# EAGLE design cougar mmjoy (EAGLE 7.5.0)
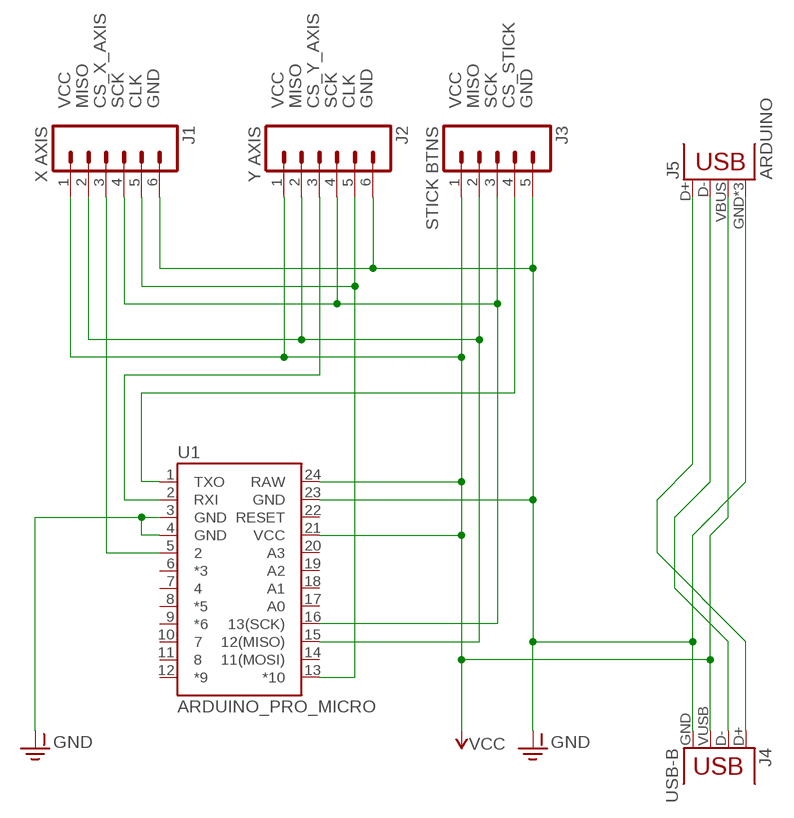
[diagram p0: schematic, sheet 1]

## Parts
J1  X AXIS  M06POLAR_LOCK  [MOLEX-1X6_LOCK]
J2  Y AXIS  M06POLAR_LOCK  [MOLEX-1X6_LOCK]
J3  STICK BTNS  M05LOCK  [1X05_LOCK]
J4  USB-B  USB-B-S  [USB-B-SMT]
J5  ARDUINO  USB-MICROB  [USB-MICROB]
U1  ARDUINO_PRO_MICRO  [ARDUINO_PRO_MICRO]

## Nets
CLK: J1.5 J2.5 U1.13(*10)
CS_STICK: J3.4 U1.1(TXO)
CS_X_AXIS: J1.3 U1.5
CS_Y_AXIS: J2.3 U1.2(RXI)
GND: J1.6 J2.6 J3.5 J4.GND J5.GND J5.MT1(GND) J5.MT2(GND) U1.3(GND) U1.4(GND) U1.23(GND)
MISO: J1.2 J2.2 J3.2 U1.15(12(MISO))
N$3: J4.D- J5.D-
N$4: J4.D+ J5.D+
SCK: J1.4 J2.4 J3.3 U1.16(13(SCK))
VCC: J1.1 J2.1 J3.1 J4.VUSB(VBUS) J5.VBUS U1.21(VCC) U1.24(RAW)
Unconnected: U1.6(*3) U1.7 U1.8(*5) U1.9(*6) U1.10 U1.11 U1.12(*9) U1.14(11(MOSI)) U1.17(A0) U1.18(A1) U1.19(A2) U1.20(A3) U1.22(RESET)

## Library data of the parts
J1 J2 = SparkFun-Connectors:M06: Header 6 Standard 6-pin 0.1" header. Use with straight break away headers (SKU : PRT-00116), right angle break away headers (PRT-00553), swiss pins (PRT-00743), machine pins (PRT-00117), and female headers (PRT-00115). Molex polarized connector foot print use with SKU : PRT-08094 with associated crimp pins and housings. NOTES ON THE VARIANTS LOCK and LOCK_LONGPADS... This footprint was designed to help hold the alignment of a through-hole component (i.e. 6-pin header) while soldering it into place. You may notice that each hole has been shifted either up or down by 0.005 of an inch from it's more standard position (which is a perfectly straight line). This slight alteration caused the pins (the squares in the middle) to touch the edges of the holes. Because they are alternating, it causes a "brace" to hold the component in place. 0.005 has proven to be the perfect amount of "off-center" position when using our standard breakaway headers. Although looks a little odd when you look at the bare footprint, once you have a header in there, the alteration is very hard to notice. Also,if you push a header all the way into place, it is covered up entirely on the bottom side. This idea of altering the position of holes to aid alignment will be further integrated into the Sparkfun Library for other footprints. It can help hold any component with 3 or more connection pins.
J3 = SparkFun-Connectors:M05: Header 5 Standard 5-pin 0.1" header. Use with straight break away headers (SKU : PRT-00116), right angle break away headers (PRT-00553), swiss pins (PRT-00743), machine pins (PRT-00117), and female headers (PRT-00115). Molex polarized connector foot print use with SKU : PRT-08230 with associated crimp pins and housings.
J4 = SparkFun-Connectors:USB: USB Connectors USB-B-PTH is fully proven SKU : PRT-00139/CONN-08278 USB-miniB is fully proven SKU : PRT-00587 USB-A-PCB is untested. USB-A-H is throughly reviewed, but untested. Spark Fun Electronics SKU : PRT-00437 USB-B-SMT is throughly reviewed, but untested. Needs silkscreen touching up. USB-A-S has not been used/tested USB-MB-H has not been used/tested USB-MICROB has been used. CONN-09505
J5 = SparkFun-Connectors:USB: USB Connectors USB-B-PTH is fully proven SKU : PRT-00139/CONN-08278 USB-miniB is fully proven SKU : PRT-00587 USB-A-PCB is untested. USB-A-H is throughly reviewed, but untested. Spark Fun Electronics SKU : PRT-00437 USB-B-SMT is throughly reviewed, but untested. Needs silkscreen touching up. USB-A-S has not been used/tested USB-MB-H has not been used/tested USB-MICROB has been used. CONN-09505; PROD_ID: CONN-09505
U1 = SparkFun-Boards:ARDUINO_PRO_MICRO

## Board
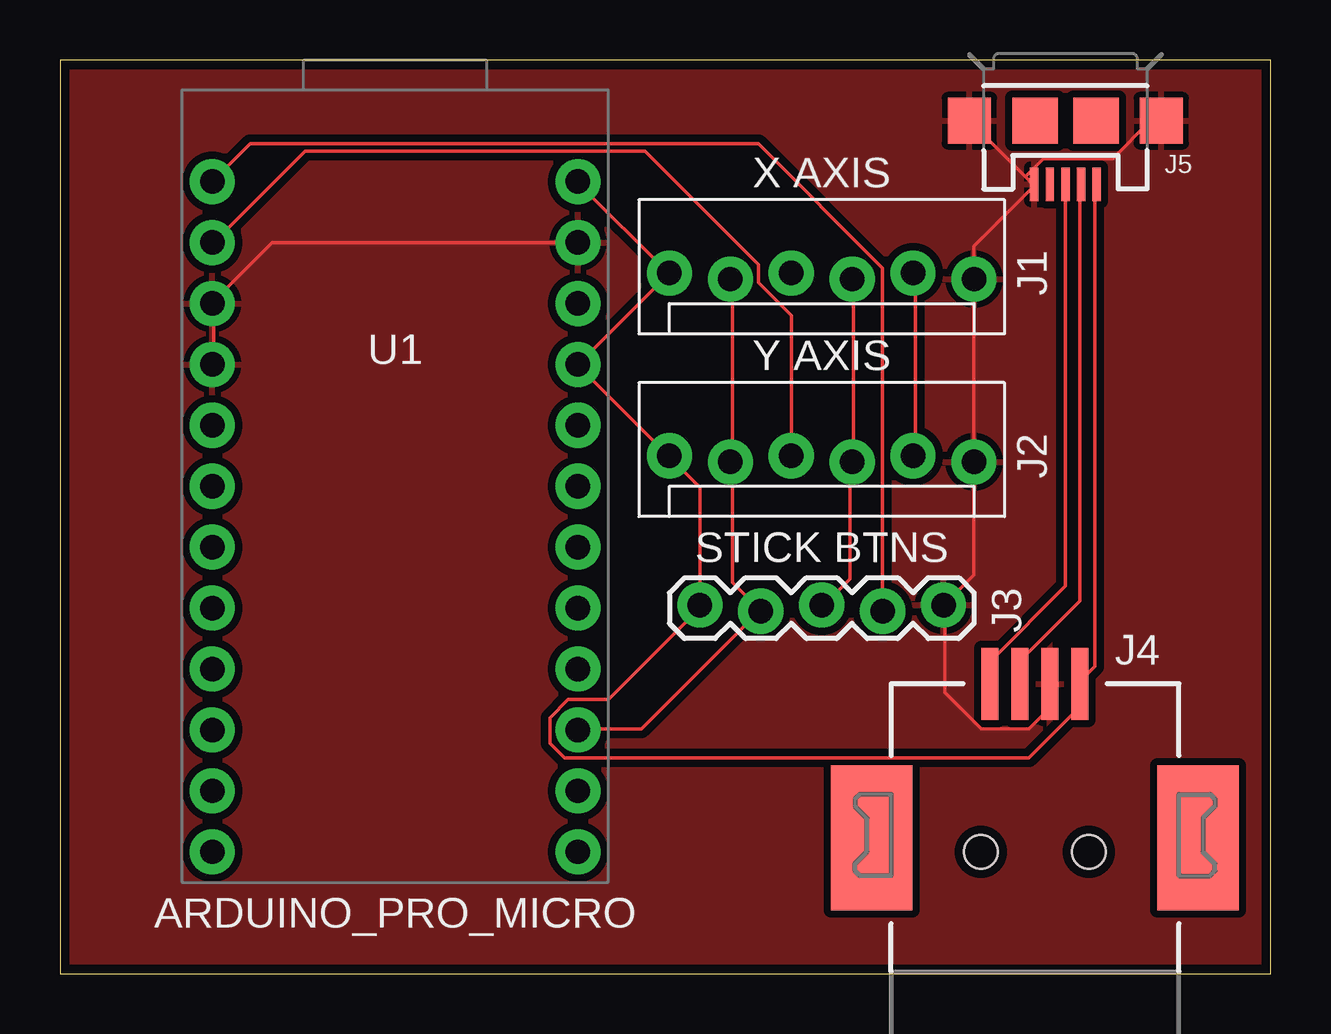
[diagram p1: board, top side]
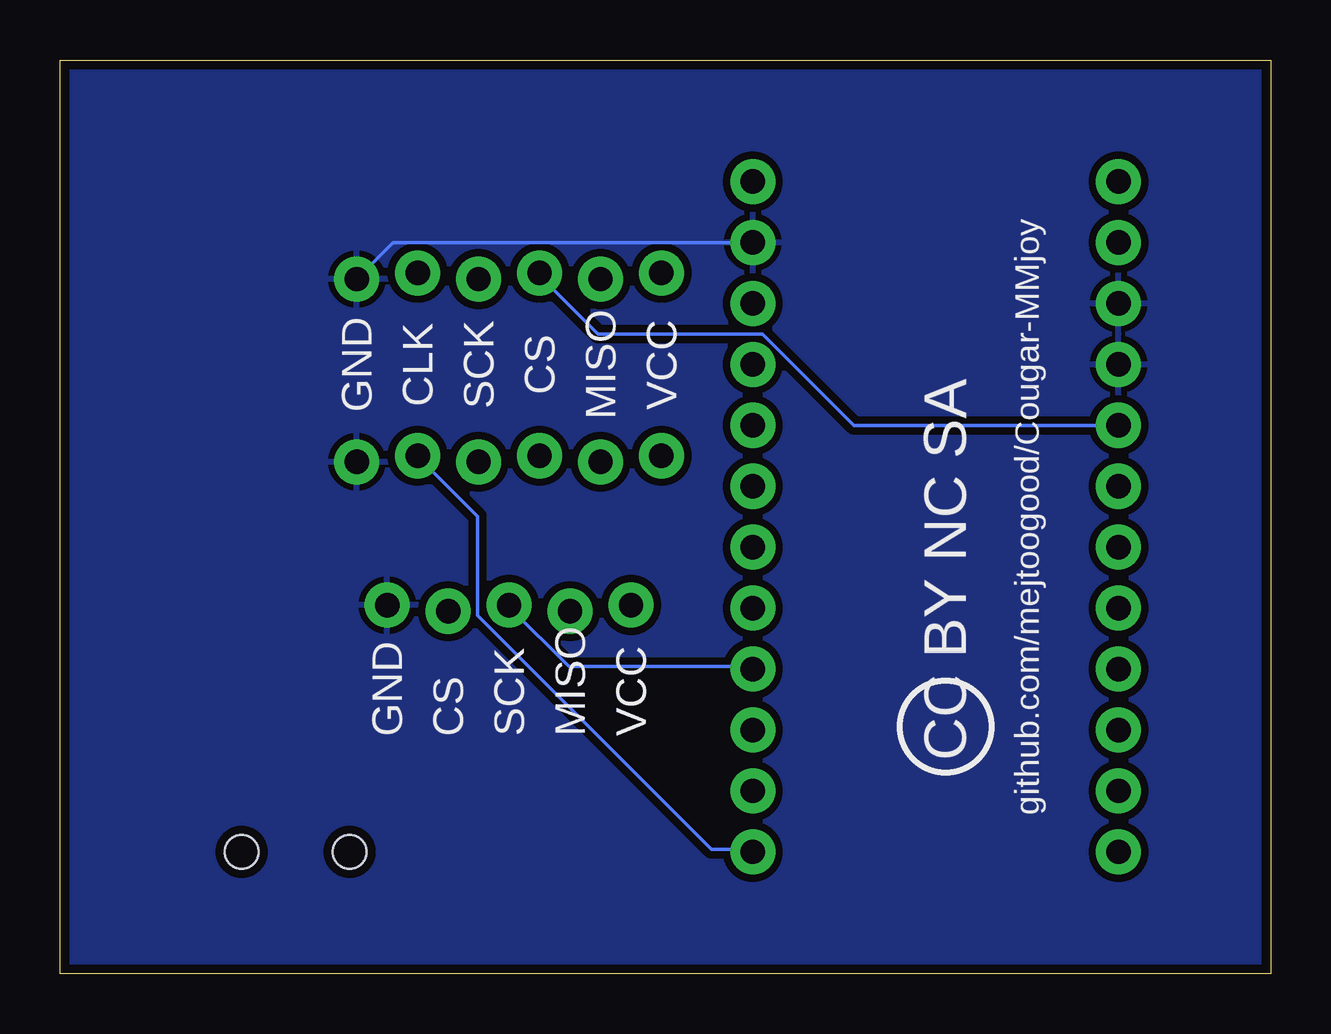
[diagram p2: board, bottom side, seen from below]

Size 50.47 x 38.09 mm. Coordinates in mm from the lower left corner, seen from the top.
Outline: 0,0 50.47,0 50.47,38.09 0,38.09 0,0
Copper layers (1*16): Top 0.0356mm / dielectric 1.5011mm / Bottom 0.0356mm
Design rules "OSH Park 2layer": minimum track width 6mil, minimum drill 13mil, track to track 6mil, track to pad 6mil, pad to pad 6mil, via to via 6mil, smd to smd 6mil, copper to edge 15mil, drill to drill 6mil, minimum pad ring 7mil, minimum via ring 7mil, stop-mask expansion 2.5mil, vias tented up to drill 0mil, thermal gap 10mil

### Footprints (pad centres in the part's own frame; a part is rotated, then mirrored left to right if it is on the bottom)
MOLEX-1X6_LOCK = drill 1.016 pad 1.88: 1 0,0; 2 2.54,-0.254; 3 5.08,0; 4 7.62,-0.254; 5 10.16,0; 6 12.7,-0.254
1X05_LOCK = drill 1.016 pad 1.88: 1 0,0.127; 2 2.54,-0.127; 3 5.08,0.127; 4 7.62,-0.127; 5 10.16,0.127
USB-B-SMT = smd 6.04 x 3.4: 5 0.58,6.8; 6 0.58,-6.8 | smd 3 x 0.7: D+ 7,1.875; D- 7,0.625; GND 7,-0.625; VUSB 7,-1.875 | hole 1.4: 0,2.25; 0,-2.25
USB-MICROB = smd 0.35 x 1.4: D+ 0,2.65; D- -0.65,2.65; GND 1.3,2.65; ID 0.65,2.65; VBUS -1.3,2.65 | smd 1.8 x 1.9: MT1 -4,0; MT2 4,0 | smd 1.9 x 1.9: P$1 -1.27,0; P$2 1.27,0
ARDUINO_PRO_MICRO = drill 1.016 pad 1.88: 1 -7.62,12.7; 2 -7.62,10.16; 3 -7.62,7.62; 4 -7.62,5.08; 5 -7.62,2.54; 6 -7.62,0; 7 -7.62,-2.54; 8 -7.62,-5.08; 9 -7.62,-7.62; 10 -7.62,-10.16; 11 -7.62,-12.7; 12 -7.62,-15.24; 13 7.62,-15.24; 14 7.62,-12.7; 15 7.62,-10.16; 16 7.62,-7.62; 17 7.62,-5.08; 18 7.62,-2.54; 19 7.62,0; 20 7.62,2.54; 21 7.62,5.08; 22 7.62,7.62; 23 7.62,10.16; 24 7.62,12.7

### Placement (x,y rotation side)
J1  25.4,29.21 0 top
J2  25.4,21.59 0 top
J3  26.67,15.24 0 top
J4  40.64,5.08 90 top
J5  41.91,35.56 180 top
U1  13.97,20.32 0 top

### Tracks (layer width: path | path; a pad name or v marks a point on that pad's centre or on a via)
CLK
  Top 0.152: J1.5 35.66,29.11 35.66,21.64 J2.5
  Bottom 0.152: U1.13 21.64,5.18 23.32,5.18 33.07,14.94 33.07,19.05 35.51,21.49 J2.5
CS_STICK
  Top 0.152: J3.4 34.29,29.41 29.11,34.59 7.92,34.59 U1.1
CS_X_AXIS
  Bottom 0.152: U1.5 17.37,22.86 21.18,26.67 28.04,26.67 30.48,29.11 J1.3
CS_Y_AXIS
  Top 0.152: J2.3 30.48,27.43 29.11,28.8 29.11,29.57 24.38,34.29 10.21,34.29 6.4,30.48 U1.2
GND
  Top 0.152: 41.3,13.11 41.3,12.19 J4.GND | 41.15,10.97 41.15,12.04 J4.GND | U1.4 6.4,25.45 6.4,27.89 U1.3 6.4,28.04 8.84,30.48 U1.23 | 40.23,33.22 37.95,35.51 J5.MT2 | 40.23,33.22 40.54,32.92 J5.GND 40.54,32.77 38.1,30.33 J1.6 J2.6 38.1,16.61 36.88,15.39 J3.5 36.88,15.24 36.88,11.73 38.41,10.21 40.39,10.21 41.15,10.97 | 40.23,33.22 41,33.98 43.89,33.98 45.41,35.51 45.87,35.51 J5.MT1 | 41.15,10.97 J4.GND
  Bottom 0.152: U1.23 36.58,30.48 J1.6
  pour Top (isolate 0.305): 0,0 0,38.1 50.8,38.1 50.8,0
  pour Bottom (isolate 0.305): 0,0 0,38.1 50.8,38.1 50.8,0
MISO
  Top 0.152: U1.15 21.64,10.21 24.23,10.21 29.11,15.09 J3.2 29.11,15.24 28.04,16.31 28.04,21.34 | 28.04,21.34 28.04,28.96 J1.2 | 28.04,21.34 J2.2
N$3
  Top 0.152: 40.08,13.11 40.08,12.19 J4.D- 40.08,13.11 | 40.08,13.11 42.52,15.54 42.52,32.77 J5.D-
N$4
  Top 0.152: 38.86,13.11 38.86,12.19 J4.D+ 38.86,13.11 | J5.D+ 41.91,16.15 38.86,13.11
SCK
  Top 0.152: J3.3 31.85,15.39 32.92,16.46 32.92,21.34 J2.4 33.07,21.34 33.07,28.96 J1.4
  Bottom 0.152: U1.16 21.64,12.8 29.26,12.8 31.7,15.24 J3.3
VCC
  Top 0.152: 43.13,32.92 J5.VBUS 43.13,32.77 43.13,12.8 42.52,12.19 J4.VUSB 42.37,12.04 42.37,10.97 40.39,8.99 21.03,8.99 20.42,9.6 20.42,10.67 21.18,11.43 22.86,11.43 26.67,15.24 J3.1 26.67,20.27 25.45,21.49 J2.1 25.3,21.64 21.64,25.3 U1.21 J1.1 25.3,29.26 21.64,32.92 U1.24

### Text on the board
bPlace: GND / CLK / SCK / CS / MISO / VCC | github.com/mejtoogood/Cougar-MMjoy | GND / CS / SCK / MISO / VCC | CC BY NC SA